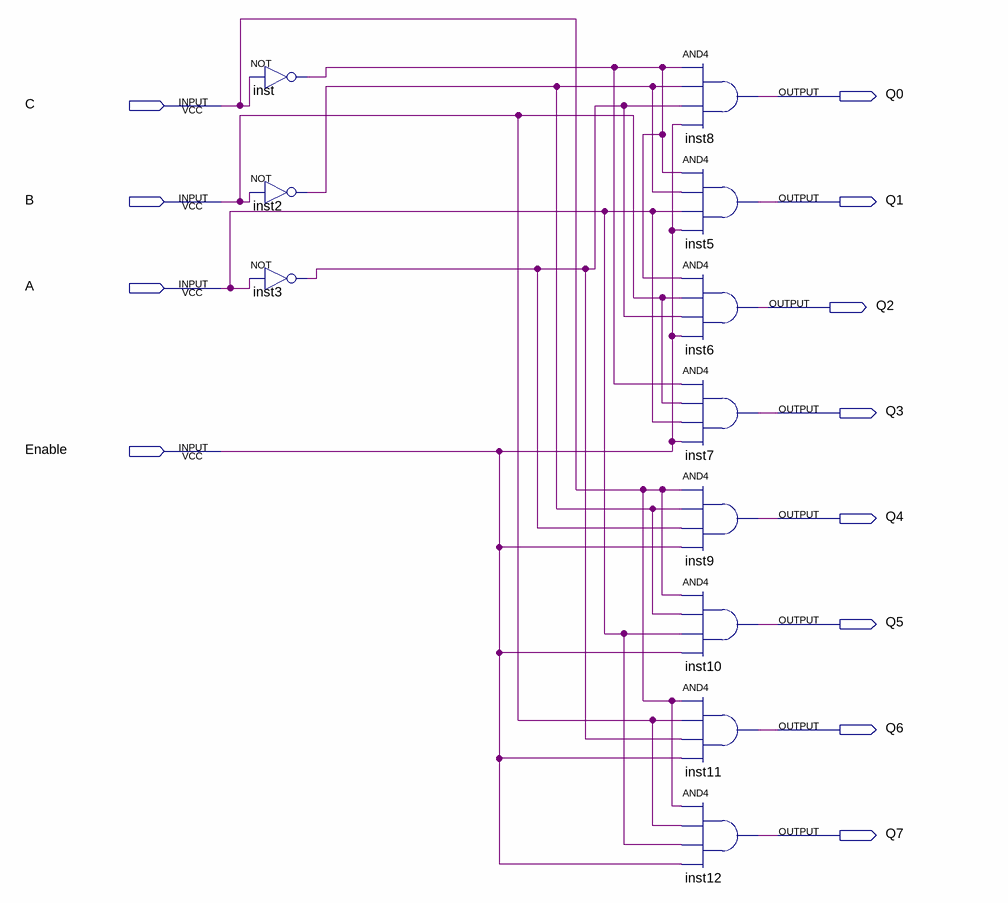
[diagram p0: schematic sheet]
// Quartus schematic s1113341_lab02_1.bdf as structural Verilog: 11 symbols, 12 pins
module s1113341_lab02_1 (
  input  C,
  input  B,
  input  A,
  input  Enable,
  output Q0,
  output Q1,
  output Q2,
  output Q3,
  output Q4,
  output Q5,
  output Q6,
  output Q7
);

  wire inst2_out, inst3_out, inst_out;

  not inst (inst_out, C);
  not inst2 (inst2_out, B);
  not inst3 (inst3_out, A);
  and inst8 (Q0, inst_out, inst2_out, inst3_out, Enable);
  and inst5 (Q1, inst_out, inst2_out, A, Enable);
  and inst6 (Q2, inst_out, B, inst3_out, Enable);
  and inst7 (Q3, inst_out, B, A, Enable);
  and inst9 (Q4, C, inst2_out, inst3_out, Enable);
  and inst10 (Q5, C, inst2_out, A, Enable);
  and inst11 (Q6, C, B, inst3_out, Enable);
  and inst12 (Q7, C, B, A, Enable);
endmodule
